# Altium schematic sheet BoardB-FPGA2.SchDoc
size A; SheetNumber: 4; SheetTotal: 9
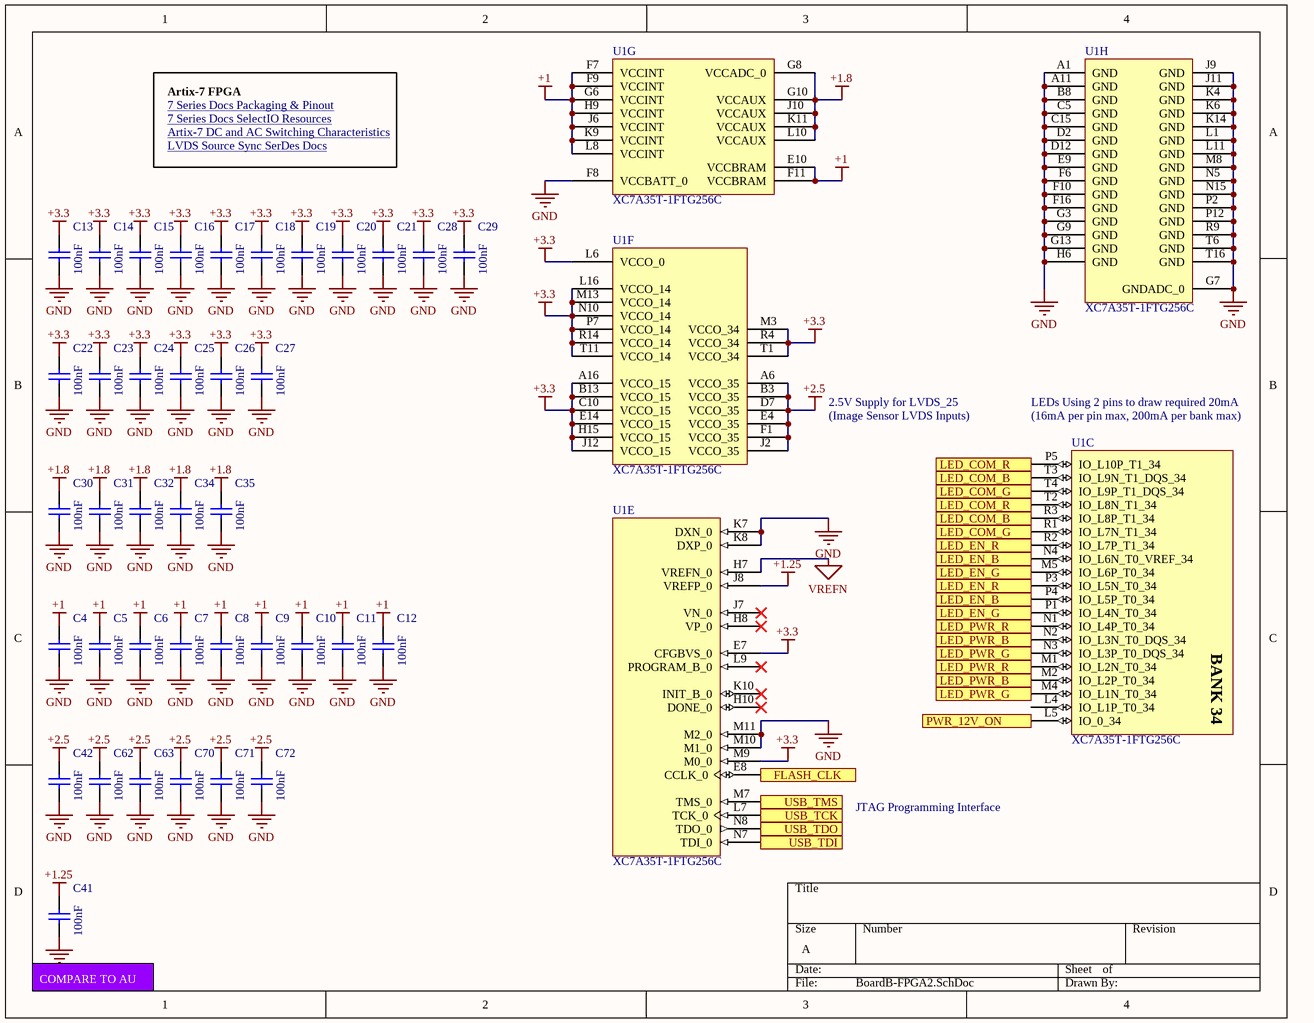
[diagram p0: BoardB-FPGA2.SchDoc]

## Parts
C4  100nF  [CAPC0603X33X15ML03T05]
C5  100nF  [CAPC0603X33X15ML03T05]
C6  100nF  [CAPC0603X33X15ML03T05]
C7  100nF  [CAPC0603X33X15ML03T05]
C8  100nF  [CAPC0603X33X15ML03T05]
C9  100nF  [CAPC0603X33X15ML03T05]
C10  100nF  [CAPC0603X33X15ML03T05]
C11  100nF  [CAPC0603X33X15ML03T05]
C12  100nF  [CAPC0603X33X15ML03T05]
C13  100nF  [CAPC0603X33X15ML03T05]
C14  100nF  [CAPC0603X33X15ML03T05]
C15  100nF  [CAPC0603X33X15ML03T05]
C16  100nF  [CAPC0603X33X15ML03T05]
C17  100nF  [CAPC0603X33X15ML03T05]
C18  100nF  [CAPC0603X33X15ML03T05]
C19  100nF  [CAPC0603X33X15ML03T05]
C20  100nF  [CAPC0603X33X15ML03T05]
C21  100nF  [CAPC0603X33X15ML03T05]
C22  100nF  [CAPC0603X33X15ML03T05]
C23  100nF  [CAPC0603X33X15ML03T05]
C24  100nF  [CAPC0603X33X15ML03T05]
C25  100nF  [CAPC0603X33X15ML03T05]
C26  100nF  [CAPC0603X33X15ML03T05]
C27  100nF  [CAPC0603X33X15ML03T05]
C28  100nF  [CAPC0603X33X15ML03T05]
C29  100nF  [CAPC0603X33X15ML03T05]
C30  100nF  [CAPC0603X33X15ML03T05]
C31  100nF  [CAPC0603X33X15ML03T05]
C32  100nF  [CAPC0603X33X15ML03T05]
C34  100nF  [CAPC0603X33X15ML03T05]
C35  100nF  [CAPC0603X33X15ML03T05]
C41  100nF  [CAPC0603X33X15ML03T05]
C42  100nF  [CAPC0603X33X15ML03T05]
C62  100nF  [CAPC0603X33X15ML03T05]
C63  100nF  [CAPC0603X33X15ML03T05]
C70  100nF  [CAPC0603X33X15ML03T05]
C71  100nF  [CAPC0603X33X15ML03T05]
C72  100nF  [CAPC0603X33X15ML03T05]
U1  XC7A35T-1FTG256C  [FTG256]  (parts C,E,F,G,H of 8)

## Ports
FLASH_CLK (in), LED_COM_B (out), LED_COM_G (out), LED_COM_R (out), LED_EN_B (out), LED_EN_G (out), LED_EN_R (out), LED_PWR_B (out), LED_PWR_G (out), LED_PWR_R (out), PWR_12V_ON (out), USB_TCK, USB_TDI, USB_TDO, USB_TMS

## Nets
+1: C4.2 C5.2 C6.2 C7.2 C8.2 C9.2 C10.2 C11.2 C12.2 U1.E10(VCCBRAM) U1.F7(VCCINT) U1.F9(VCCINT) U1.F11(VCCBRAM) U1.G6(VCCINT) U1.H9(VCCINT) U1.J6(VCCINT) U1.K9(VCCINT) U1.L8(VCCINT)
+1.8: C30.2 C31.2 C32.2 C34.2 C35.2 U1.G8(VCCADC_0) U1.G10(VCCAUX) U1.J10(VCCAUX) U1.K11(VCCAUX) U1.L10(VCCAUX)
+1.25: C41.2 U1.J8(VREFP_0)
+2.5: C42.2 C62.2 C63.2 C70.2 C71.2 C72.2 U1.A6(VCCO_35) U1.B3(VCCO_35) U1.D7(VCCO_35) U1.E4(VCCO_35) U1.F1(VCCO_35) U1.J2(VCCO_35)
+3.3: C13.2 C14.2 C15.2 C16.2 C17.2 C18.2 C19.2 C20.2 C21.2 C22.2 C23.2 C24.2 C25.2 C26.2 C27.2 C28.2 C29.2 U1.A16(VCCO_15) U1.B13(VCCO_15) U1.C10(VCCO_15) U1.E7(CFGBVS_0) U1.E14(VCCO_15) U1.H15(VCCO_15) U1.J12(VCCO_15) U1.L6(VCCO_0) U1.L16(VCCO_14) U1.M3(VCCO_34) U1.M9(M0_0) U1.M13(VCCO_14) U1.N10(VCCO_14) U1.P7(VCCO_14) U1.R4(VCCO_34) U1.R14(VCCO_14) U1.T1(VCCO_34) U1.T11(VCCO_14)
GND: C4.1 C5.1 C6.1 C7.1 C8.1 C9.1 C10.1 C11.1 C12.1 C13.1 C14.1 C15.1 C16.1 C17.1 C18.1 C19.1 C20.1 C21.1 C22.1 C23.1 C24.1 C25.1 C26.1 C27.1 C28.1 C29.1 C30.1 C31.1 C32.1 C34.1 C35.1 C41.1 C42.1 C62.1 C63.1 C70.1 C71.1 C72.1 U1.A1(GND) U1.A11(GND) U1.B8(GND) U1.C5(GND) U1.C15(GND) U1.D2(GND) U1.D12(GND) U1.E9(GND) U1.F6(GND) U1.F8(VCCBATT_0) U1.F10(GND) U1.F16(GND) U1.G3(GND) U1.G7(GNDADC_0) U1.G9(GND) U1.G13(GND) U1.H6(GND) U1.J9(GND) U1.J11(GND) U1.K4(GND) U1.K6(GND) U1.K7(DXN_0) U1.K8(DXP_0) U1.K14(GND) U1.L1(GND) U1.L11(GND) U1.M8(GND) U1.M10(M1_0) U1.M11(M2_0) U1.N5(GND) U1.N15(GND) U1.P2(GND) U1.P12(GND) U1.R9(GND) U1.T6(GND) U1.T16(GND)
VREFN: U1.H7(VREFN_0)
FLASH_CLK: U1.E8(CCLK_0) ; port FLASH_CLK
LED_COM_B: U1.R3(IO_L8P_T1_34) U1.T3(IO_L9N_T1_DQS_34) ; port LED_COM_B
LED_COM_G: U1.R1(IO_L7N_T1_34) U1.T4(IO_L9P_T1_DQS_34) ; port LED_COM_G
LED_COM_R: U1.P5(IO_L10P_T1_34) U1.T2(IO_L8N_T1_34) ; port LED_COM_R
LED_EN_B: U1.N4(IO_L6N_T0_VREF_34) U1.P4(IO_L5P_T0_34) ; port LED_EN_B
LED_EN_G: U1.M5(IO_L6P_T0_34) U1.P1(IO_L4N_T0_34) ; port LED_EN_G
LED_EN_R: U1.P3(IO_L5N_T0_34) U1.R2(IO_L7P_T1_34) ; port LED_EN_R
LED_PWR_B: U1.M2(IO_L2P_T0_34) U1.N2(IO_L3N_T0_DQS_34) ; port LED_PWR_B
LED_PWR_G: U1.M4(IO_L1N_T0_34) U1.N3(IO_L3P_T0_DQS_34) ; port LED_PWR_G
LED_PWR_R: U1.M1(IO_L2N_T0_34) U1.N1(IO_L4P_T0_34) ; port LED_PWR_R
PWR_12V_ON: U1.L5(IO_0_34) ; port PWR_12V_ON
USB_TCK: U1.L7(TCK_0) ; port USB_TCK
USB_TDI: U1.N7(TDI_0) ; port USB_TDI
USB_TDO: U1.N8(TDO_0) ; port USB_TDO
USB_TMS: U1.M7(TMS_0) ; port USB_TMS

Not connected (* = marked no-connect by the designer): U1 H8(VP_0)* H10(DONE_0)* J7(VN_0)* K10(INIT_B_0)* L4(IO_L1P_T0_34) L9(PROGRAM_B_0)*

## Notes on the sheet
- Artix-7 FPGA
- 7 Series Docs Packaging & Pinout <https://www.xilinx.com/support/documentation/user_guides/ug475_7Series_Pkg_Pinout.pdf>
- 7 Series Docs SelectIO Resources <https://www.xilinx.com/support/documentation/user_guides/ug471_7Series_SelectIO.pdf>
- Artix-7 DC and AC Switching Characteristics <https://www.xilinx.com/support/documentation/data_sheets/ds181_Artix_7_Data_Sheet.pdf>
- LVDS Source Sync SerDes Docs <https://www.xilinx.com/content/dam/xilinx/support/documentation/application_notes/xapp585-lvds-source-synch-serdes-clock-multiplication.pdf>
- 2.5V Supply for LVDS_25
- (Image Sensor LVDS Inputs)
- LEDs Using 2 pins to draw required 20mA
- (near U1) (16mA per pin max, 200mA per bank max)
- JTAG Programming Interface
- (near C41) COMPARE TO AU
- (in symbol CMP-0383-00028-1, part C) BANK 34

## Library data of the parts
C4-C32 C34 C35 C41 C42 C62 C63 C70-C72 = CMP-2010-00674-1: Manufacturer: Samsung; Part Number: CL03A104KQ3NNNC
U1 = CMP-0383-00028-1: Artix-7 FPGA, 170 User I/Os, 0 GTP, 256-Ball BGA, Speed Grade 1, Commercial Grade, Pb-Free; Manufacturer: Xilinx; Speed Grades: 1; Total Block RAM: 1800 Kb; CMTs: 5; GTP: 0; Available User I/O: 170; Logic Cells: 33280; ComponentLink2Description: Datasheet; ComponentLink2URL: http://www.xilinx.com/support/documentation/data_sheets/ds180_7Series_Overview.pdf; ComponentLink1Description: Manufacturer URL; Operating Temperature Range: Commercial; PackageVersion: Rev. 1.11; ComponentLink4URL: http://www.xilinx.com/support/documentation/user_guides/ug475_7Series_Pkg_Pinout.pdf; ComponentLink4Description: Package Specification; PackageDescription: 256-Ball Wire-Bond Fine-Pitch Thin BGA, Body 17 x 17 mm, Pitch 1 mm; Mounting Technology: Surface Mount; ComponentLink1URL: http://www.xilinx.com/; Maximum Distributed RAM: 400 Kb; PackageReference: FTG-256; DatasheetVersion: Rev. 1.15; ComponentLink3Description: Pinout; PartNumber: XC7A35T-1FTG256C; ComponentLink3URL: http://www.xilinx.com/support/documentation/user_guides/ug475_7Series_Pkg_Pinout.pdf